# Altium schematic sheet PFE-EVSE.SchDoc
size A4
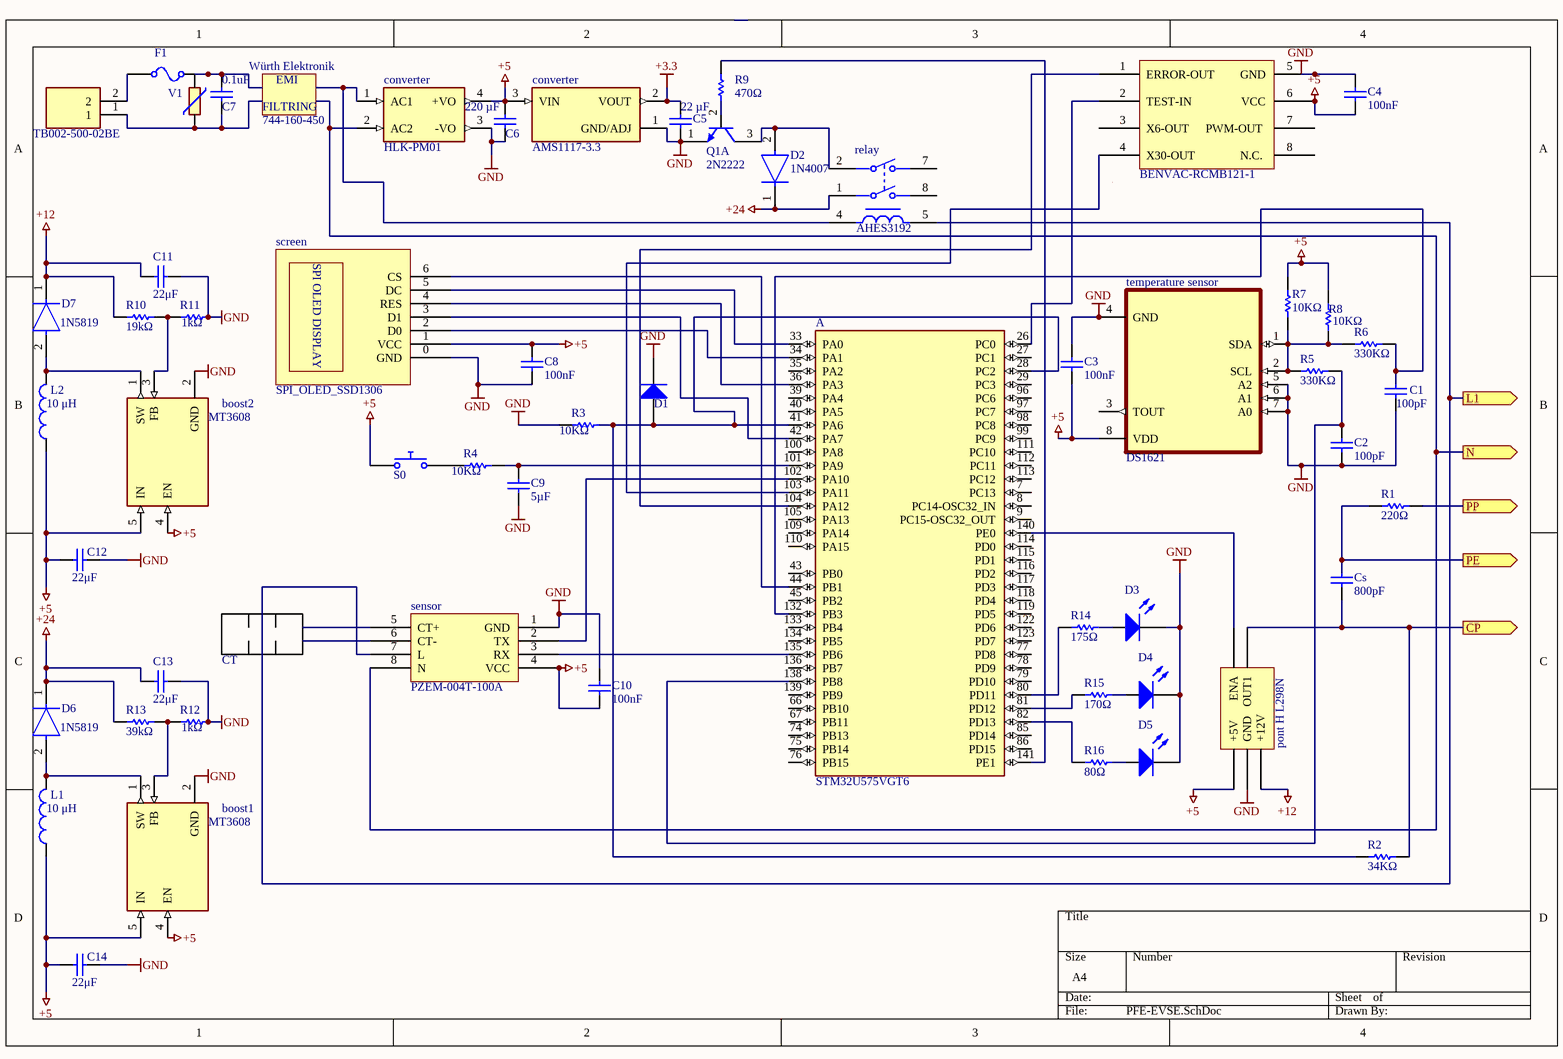
[diagram p0: PFE-EVSE.SchDoc]

## Parts
(Parts that share a designator on the sheet are numbered #1, #2 ... from top to bottom, then left to right.)
?#1  Fuse  (value not drawn)
?#2  TB002-500-02BE  [CUI_TB002-500-02BE]
?#3  BENVAC-RCMB121-1
?#4  SPI_OLED_SSD1306
?#5  STM32U575VGT6  [QFP50P2200X2200X160-144N]  (part A of 3)
?#6  pont H L298N
boost1  MT3608  [SOT95P280X145-6N]
boost2  MT3608  [SOT95P280X145-6N]
C1  value 100pF  (hidden comment: Capacitor)
C2  value 100pF  (hidden comment: Capacitor)
C3  value 100nF  (hidden comment: Capacitor)
C4  value 100nF  (hidden comment: Capacitor)
C5  Capacitor  (value not drawn)
C6  220 µF  (value not drawn)
C7  value 0.1uF  (hidden comment: Capacitor)
C8  value 100nF  (hidden comment: Capacitor)
C9  value 5µF  (hidden comment: Capacitor)
C10  value 100nF  (hidden comment: Capacitor)
C11  value 22μF  (hidden comment: Capacitor)
C12  value 22μF  (hidden comment: Capacitor)
C13  value 22μF  (hidden comment: Capacitor)
C14  value 22μF  (hidden comment: Capacitor)
converter#1  HLK-PM01  [CONV_HLK-PM01]
converter#2  AMS1117-3.3  [SOT229P700X180-4N]
Cs  value 800pF  (hidden comment: Capacitor)
D1  Diode  (value not drawn)
D2  1N4007  [FP-1N4007-MFG]
D3  Light-Emitting Diode  (value not drawn)
D4  Light-Emitting Diode  (value not drawn)
D5  Light-Emitting Diode  (value not drawn)
D6  (no value)  [FP-1N4007-MFG]
D7  (no value)  [FP-1N4007-MFG]
L1  value 10 μH  (hidden comment: Inductor)
L2  value 10 μH  (hidden comment: Inductor)
Q1  2N2222  [MLTC-TO-18-3]  (part A of 3)
R1  value 220Ω  (hidden comment: Resistor)
R2  value 34KΩ  (hidden comment: Resistor)
R3  value 10KΩ  (hidden comment: Resistor)
R4  value 10KΩ  (hidden comment: Resistor)
R5  value 330KΩ  (hidden comment: Resistor)
R6  value 330KΩ  (hidden comment: Resistor)
R7  value 10KΩ  (hidden comment: Resistor)
R8  value 10KΩ  (hidden comment: Resistor)
R9  value 470Ω  (hidden comment: Resistor)
R10  value 19kΩ  (hidden comment: Resistor)
R11  value 1kΩ  (hidden comment: Resistor)
R12  value 1kΩ  (hidden comment: Resistor)
R13  value 39kΩ  (hidden comment: Resistor)
R14  value 175Ω  (hidden comment: Resistor)
R15  value 170Ω  (hidden comment: Resistor)
R16  value 80Ω  (hidden comment: Resistor)
relay  AHES3192  [FP-AHES3192-MFG]
S0  Push Button Normally Opened  (value not drawn)
sensor  PZEM-004T-100A
temperature_sensor  DS1621  [DIP794W47P254L991H457Q8]
V1  (no value)  [MOV-10D561]

## Ports
CP (out), L1 (out), N (out), PE (out), PP (out)

## Nets
+3.3: C5.2 converter#2.2(VOUT)
+5: ?#3.6(VCC) ?#4.1(VCC) ?#6.?1(+5V) boost1.4(EN) boost1.5(IN) boost2.4(EN) boost2.5(IN) C3.1 C4.1 C6.2 C8.2 C10.1 C12.2 C14.2 converter#1.4(+VO) converter#2.3(VIN) L1.1 L2.1 R7.2 R8.2 S0.1 sensor.4(VCC) temperature_sensor.8(VDD)
+12: ?#6.?3(+12V) C11.1 D7.1(C) R10.1
+24: C13.1 D2.1(C) D6.1(C) R13.1 relay.1
GND: ?#3.5(GND) ?#4.0(GND) ?#6.?2(GND) boost1.2(GND) boost2.2(GND) C1.1 C2.1 C3.2 C4.2 C5.1 C6.1 C8.1 C9.2 C10.2 C11.2 C12.1 C13.2 C14.1 converter#1.3(-VO) converter#2.1(GND/ADJ) D1.2(K) D3.2(K) D4.2(K) D5.2(K) Q1.1(E) R3.1 R11.2 R12.2 sensor.1(GND) temperature_sensor.4(GND) temperature_sensor.5(A2) temperature_sensor.6(A1) temperature_sensor.7(A0)
CP: ?#6.?5(OUT1) Cs.1 R2.2 ; port CP
L1: relay.5 sensor.7(L) ; port L1
N: converter#1.2(AC2) sensor.8(N) ; port N
PE: Cs.2 R1.1 ; port PE
PP: R1.2 ; port PP
Net?#1_1: ?#1.1 ?#2.2
Net?#1_2: ?#1.2 C7.2 V1.2
Net?#2_1: ?#2.1 C7.1 V1.1
Net?#3_1: ?#3.1(ERROR-OUT) ?#5.104(PA12)
Net?#3_2: ?#3.2(TEST-IN) ?#5.26(PC0)
Net?#3_4: ?#3.4(X30-OUT) ?#5.103(PA11)
Net?#4_2: ?#4.2(D0) ?#5.34(PA1)
Net?#4_3: ?#4.3(D1) ?#5.42(PA7)
Net?#4_4: ?#4.4(RES) ?#5.36(PA3)
Net?#4_5: ?#4.5(DC) ?#5.33(PA0)
Net?#4_6: ?#4.6(CS) ?#5.44(PB1)
Net?#5_28: ?#5.28(PC2) ?#5.41(PA6) D1.1(A) R2.1 R3.2
Net?#5_80: ?#5.80(PD11) R14.1
Net?#5_81: ?#5.81(PD12) R15.1
Net?#5_82: ?#5.82(PD13) R16.1
Net?#5_101: ?#5.101(PA9) C9.1 R4.2
Net?#5_102: ?#5.102(PA10) sensor.2(TX)
Net?#5_132: ?#5.132(PB3) C1.2 R6.2
Net?#5_135: ?#5.135(PB6) sensor.3(RX)
Net?#5_138: ?#5.138(PB8) C2.2 R5.2
Net?#5_140: ?#5.140(PE0) ?#6.?4(ENA)
Net?#5_141: ?#5.141(PE1) R9.2
Netboost1_1: boost1.1(SW) D6.2(A) L1.2
Netboost1_3: boost1.3(FB) R12.1 R13.2
Netboost2_1: boost2.1(SW) D7.2(A) L2.2
Netboost2_3: boost2.3(FB) R10.2 R11.1
Netconverter#1_1: converter#1.1(AC1) relay.4
NetD2_2: D2.2(A) Q1.3(C) relay.2
NetD3_1: D3.1(A) R14.2
NetD4_1: D4.1(A) R15.2
NetD5_1: D5.1(A) R16.2
NetQ1_2: Q1.2(B) R9.1
NetR4_1: R4.1 S0.2
NetR5_1: R5.1 R6.1 R7.1 R8.1 temperature_sensor.1(SDA) temperature_sensor.2(SCL)

Not connected (* = marked no-connect by the designer): ?#3 3(X6-OUT) 7(PWM-OUT_) 8(N.C._); ?#5 7(PC13) 8(PC14-OSC32_IN) 9(PC15-OSC32_OUT) 27(PC1) 29(PC3) 35(PA2) 39(PA4) 40(PA5) 43(PB0) 45(PB2) 66(PB10) 67(PB11) 74(PB13) 75(PB14) 76(PB15) 77(PD8) 78(PD9) 79(PD10) 85(PD14) 86(PD15) 96(PC6) 97(PC7) 98(PC8) 99(PC9) 100(PA8) 105(PA13) 109(PA14) 110(PA15) 111(PC10) 112(PC11) 113(PC12) 114(PD0) 115(PD1) 116(PD2) 117(PD3) 118(PD4) 119(PD5) 122(PD6) 123(PD7) 133(PB4) 134(PB5) 136(PB7) 139(PB9); relay 7 8; sensor 5(CT+) 6(CT-); temperature_sensor 3(TOUT)

## Notes on the sheet
- F1
- Würth Elektronik
- 744-160-450
- (near C7) FILTRING
- EMI
- 220 µF
- (near C5) 22 µF
- screen
- (near D7) 1N5819
- CT
- (near D6) 1N5819
- (in symbol Component_1) SPI OLED DISPLAY

## Library data of the parts
?#1 = Fuse: RESISTANCE: 1m; SimulationGenericComponent: True
?#2 = TB002-500-02BE: 2~24 Poles, Screw Type, Horizontal, 5.0 Pitch, 22~12 (AWG), Terminal Block Connector; MF: CUI Devices; Purchase-URL: https://pricing.snapeda.com/search/part/TB002-500-02BE/?ref=eda; MP: TB002-500-02BE; Package: None; Price: None; Availability: In Stock; SnapEDA_Link: https://www.snapeda.com/parts/TB002-500-02BE/CUI+Devices/view-part/?ref=snap; Value: *; Check_prices: https://www.snapeda.com/parts/TB002-500-02BE/CUI+Devices/view-part/?ref=eda; CUI_purchase_URL: https://www.cuidevices.com/product/interconnect/connectors/terminal-blocks/tb002-500-series?utm_source=snapeda.com&utm_medium=referral&utm_campaign=snapedaBOM
?#3 ?#4 ?#6 sensor = Component_1
?#5 = STM32U575ZIT6Q: ARM® Cortex®-M33 STM32U5 Microcontroller IC 32-Bit 160MHz 2MB (2M x 8) FLASH 144-LQFP (20x20); MF: STMicroelectronics; SnapEDA_Link: https://www.snapeda.com/parts/STM32U575ZIT6Q/STMicroelectronics/view-part/?ref=snap; Package: None; Value: *; MP: STM32U575ZIT6Q; Check_prices: https://www.snapeda.com/parts/STM32U575ZIT6Q/STMicroelectronics/view-part/?ref=eda
boost1 boost2 = MT3608: High Efficiency 1.2MHz2A Step Up Converter; MF: Aerosemi Technology Co., Ltd; Price: None; Availability: Not in stock; Package: Package; MP: MT3608; Value: *; SnapEDA_Link: https://www.snapeda.com/parts/MT3608/Aerosemi+Technology+Co.%252C+Ltd/view-part/?ref=snap; Check_prices: https://www.snapeda.com/parts/MT3608/Aerosemi+Technology+Co.%252C+Ltd/view-part/?ref=eda
C1-C14 Cs = Capacitor: SimulationGenericComponent: True
converter#1 = HLK-PM01: The HLK-PM01 is a small size low cost AC to DC converter which can take in 110V/220V AC at 50/60 Hz and give 5V 3W output. The module is can be used in designs which run on 5V and needs to be powered form the AC mains.; MF: Hi-link; SnapEDA_Link: https://www.snapeda.com/parts/hlk-pm01/Hi-link/view-part/?ref=snap; Package: None; Value: *; MP: hlk-pm01; Check_prices: https://www.snapeda.com/parts/hlk-pm01/Hi-link/view-part/?ref=eda
converter#2 = AMS1117-3.3: Sot223/Pkg 1-Amp 3.3-Volt Low Drop Out Voltage Regulatator; MF: Advanced Monolithic Systems; Package: SOT-223 Seeed Technology; Value: *; Check_prices: https://www.snapeda.com/parts/AMS1117-3.3/Advanced+Monolithic+Systems/view-part/?ref=eda; Price: None; Availability: Not in stock; MP: AMS1117-3.3; SnapEDA_Link: https://www.snapeda.com/parts/AMS1117-3.3/Advanced+Monolithic+Systems/view-part/?ref=snap
D1 = Diode: AF: 1; BV: 0; BV_MAX: 1e99; EG: 1.11; FC: 0.5; IBV: 0.001; ISR: 1e-14; MJSW: 0.33; NTUN: 30; TNOM: 27; XTI: 3; SimulationGenericComponent: True; CJO: 0; CJP: 0; CTA: 0; CTP: 0; FCS: 0.5; FV_MAX: 1e99; IKF: 0; IKR: 0; JSW: 0; JTUN: 0; JTUNSW: 0; KEG: 1; KF: 0; LEVEL: 1; N: 1; NBV: 1; NR: 1; NS: 1; PHP: 1; RS: 0; TCV: 0; TLEV: 0; TLEVC: 0; TM1: 0; TM2: 0; TPB: 0; TPHP: 0; TRS: 0; TRS2: 0; TT: 0; TTT1: 0; TTT2: 0; VJ: 1; XTITUN: 3; IS: 1e-14
D2 = CMP-123542-000001-1: Rectifier diode 1000 V 1 A DO-41, ,; Manufacturer: Diotec; Max Surge Forward Current: 27A; Forward Current: 1A; Max Junction Temp: +175°C; Reverse Voltage: 1000V; Value: 15pF; Peak Reverse Current: 5uA; Category: Diode; Temperature Range Low: -50°C; Automotive: No; Temperature: -50°C to +175°C; Lead Free: Yes; ComponentLink2Description: Datasheet; Max Repetitive Reverse Voltage: 1000V; ComponentLink2URL: https://datasheet.octopart.com/1N4007-Diotec-datasheet-62346875.pdf; Manufacturer Part Number: 1N4007; Device Class L3: Rectifier Diodes; Height: 2.8mm; Octopart: https://octopart.com/1n4007-diotec-4040411; Package: 1N4007; Temperature Range High: +175°C; Device Class L1: Discrete Semiconductors; Device Class L2: Diodes; RoHS: TRUE; Capacitance: 15pF; Ipc Land Pattern Name: DIOAD888W100L520D280
D3-D5 = LED: AF: 1; BV: 0; BV_MAX: 1e99; EG: 1.11; FC: 0.5; IBV: 0.001; IS: 1e-14; MJSW: 0.33; NTUN: 30; TNOM: 27; XTI: 3; SimulationGenericComponent: True; CJO: 0; CJP: 0; CTA: 0; CTP: 0; FCS: 0.5; FV_MAX: 1e99; IKF: 0; IKR: 0; ISR: 1e-14; JSW: 0; JTUN: 0; JTUNSW: 0; KEG: 1; KF: 0; LEVEL: 1; N: 1; NBV: 1; NR: 1; NS: 1; PHP: 1; RS: 0; TCV: 0; TLEV: 0; TLEVC: 0; TM1: 0; TM2: 0; TPB: 0; TPHP: 0; TRS: 0; TRS2: 0; TT: 0; TTT1: 0; TTT2: 0; VJ: 1; XTITUN: 3
D6 D7 = CMP-123542-000001-1: Rectifier diode 1000 V 1 A DO-41, ,; Manufacturer Part Number: 1N4007; Manufacturer: Diotec; Max Surge Forward Current: 27A; Forward Current: 1A; Max Junction Temp: +175°C; Reverse Voltage: 1000V; Value: 15pF; Peak Reverse Current: 5uA; Category: Diode; Temperature Range Low: -50°C; Automotive: No; Temperature: -50°C to +175°C; Lead Free: Yes; ComponentLink2Description: Datasheet; Max Repetitive Reverse Voltage: 1000V; ComponentLink2URL: https://datasheet.octopart.com/1N4007-Diotec-datasheet-62346875.pdf; Device Class L3: Rectifier Diodes; Height: 2.8mm; Octopart: https://octopart.com/1n4007-diotec-4040411; Package: 1N4007; Temperature Range High: +175°C; Device Class L1: Discrete Semiconductors; Device Class L2: Diodes; RoHS: TRUE; Capacitance: 15pF; Ipc Land Pattern Name: DIOAD888W100L520D280
L1 L2 = Inductor: SimulationGenericComponent: True
Q1 = CMP-2000-05237-1: Low Power Bipolar NPN Transistor, 30 V, -65 to 200 degC, 3-Pin TO-18, RoHS, Bulk; Manufacturer: Multicomp; Pin Configuration: a; No. of Pins: 3; No. of Transistors: 1; Collector Emitter Voltage Vces: 400mV; Current Ic Continuous a Max: 800mA; Power Dissipation Pd: 500mW; Collector Emitter Voltage V(br)ceo: 30V; Gain Bandwidth ft Typ: 250MHz; Voltage Vcbo: 60V; DC Current Gain hFE: 100; Full Power Rating Temperature: 25degC; Current Ic @ Vce Sat: 150mA; SVHC: NoSVHC(19-Dec-2012); Package Reference: TO-18-3; Package Description: 3-Pin Transistor Outline Package (TO-18), Dia 5.54 mm, Pitch Pitch 1.485mm; Datasheet URL: http://www.farnell.com/datasheets/1662272.pdf; Transistor Case Style: TO-18; Continuous Collector Current Ic Max: 800mA; Manufacturer URL: http://uk.farnell.com/b/multicomp; DC Collector Current: 800mA; Hfe Min: 100; Transistor Polarity: NPN; Power Dissipation Ptot Max: 500mW; Package / Case: TO-18; Datasheet Version: Rev. 1.1, 05/2012; Gain Bandwidth ft Min: 250MHz; Current Ic hFE: 150mA
R1-R16 = Resistor: TC1: 0; SimulationGenericComponent: True; TC2: 0
relay = CMP-00287-61559455-1: AHES3192 Electromechanical Relay DPDT-NO 35A/1A 24V 306.4Ohm Through Hole, HE-S series; Coil Current: 78mA; Coil Power: 1.88W; Contact Current Rating: 35A; Coil Resistance: 306.4Ω; Release Time: 10ms; Number of Contacts: 2; Coil Type: Non-Latching; Operate Time: 30ms; Relay Type: General Purpose; Switching Current: 40A; Throw Configuration: DPST; Termination: PC Pin; Coil Voltage (DC): 24V; Packaging: Bulk; Max Operating Temperature: 55°C; Mount: Through Hole; Height: 40.3mm; Current Rating: 35A; NexarPartId: 61559455; Contact Material: Silver, Tin; RoHS: Compliant; Ambient Temperature Range High: 70°C; Min Operating Temperature: -40°C
S0 = Push Button NO: closed: 0; Rclosed: 1m; Ropen: 1Meg; SimulationGenericComponent: True
temperature_sensor = DS1621: Temperature Sensor Digital, Local -55Â°C ~ 125Â°C 8 b 8-DIP; MF: Maxim Integrated; SnapEDA_Link: https://www.snapeda.com/parts/DS1621/Maxim%20Integrated/view-part/1231399/?ref=snap; Price: None; Availability: Unavailable; Package: DIP-8 Maxim Integrated; MP: DS1621; Value: *
V1 = MOV-10D561K: 560 V 2.5 kA Varistor 1 Circuit Through Hole Disc 10mm; MF: Bourns; Value: *; SnapEDA_Link: https://www.snapeda.com/parts/MOV-10D561K/Bourns/view-part/?ref=snap; MP: MOV-10D561K; Purchase-URL: https://pricing.snapeda.com/search/part/MOV-10D561K/?ref=eda; Check_prices: https://www.snapeda.com/parts/MOV-10D561K/Bourns/view-part/?ref=eda; Availability: In Stock; Price: None; Package: Disc-10 Bourns